# Altium schematic sheet Power.SchDoc
size A
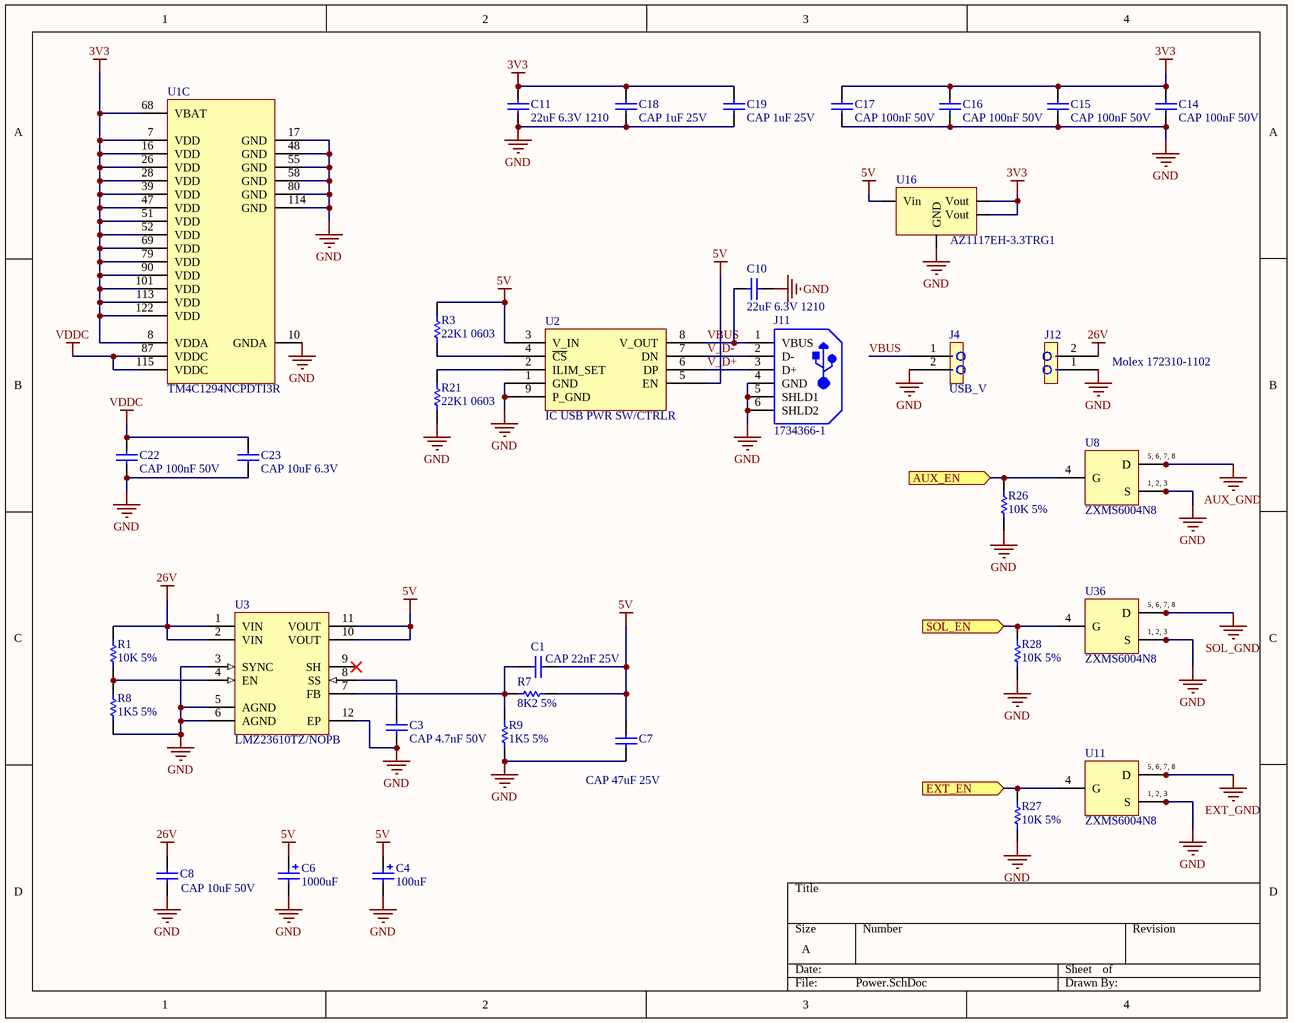
[diagram p0: Power.SchDoc]

## Parts
C1  CAP 22nF 25V  [CAPC0805(2012)100_M]
C3  CAP 4.7nF 50V  [CAPC0603(1608)100_M]
C4  100uF  [PANASONIC_C]
C6  1000uF  [PANASONIC_H13]
C7  CAP 47uF 25V  [CAPC1206(3216)100_L]
C8  CAP 10uF 50V  [CAPC1206(3216)190_M]
C10  22uF 6.3V 1210  [CAPC1210(3225)220_N]
C11  22uF 6.3V 1210  [CAPC1210(3225)220_N]
C14  CAP 100nF 50V  [CAPC0603(1608)100_M]
C15  CAP 100nF 50V  [CAPC0603(1608)100_M]
C16  CAP 100nF 50V  [CAPC0603(1608)100_M]
C17  CAP 100nF 50V  [CAPC0603(1608)100_M]
C18  CAP 1uF 25V  [CAPC0603(1608)100_M]
C19  CAP 1uF 25V  [CAPC0603(1608)100_M]
C22  CAP 100nF 50V  [CAPC0603(1608)100_M]
C23  CAP 10uF 6.3V  [CAPC0603(1608)100_M]
J4  USB_V  [1X2]
J11  1734366-1  [TE-1734366-1_V]
J12  Molex 172310-1102  [Molex 172310-1102]
R1  10K 5%  [RESC0603(1608)_M]
R3  22K1 0603  [RESC0603(1608)_N]
R7  8K2 5%  [RESC0603(1608)_M]
R8  1K5 5%  [RESC0603(1608)_M]
R9  1K5 5%  [RESC0603(1608)_M]
R21  22K1 0603  [RESC0603(1608)_N]
R26  10K 5%  [RESC0603(1608)_N]
R27  10K 5%  [RESC0603(1608)_N]
R28  10K 5%  [RESC0603(1608)_N]
U1  TM4C1294NCPDTI3R  [TI-PDT128_M]  (part C of 3)
U2  IC USB PWR SW/CTRLR  [8-MSOP-PowerPad]
U3  LMZ23610TZ/NOPB  [NDY0011A_M]
U8  ZXMS6004N8  [SO-8]
U11  ZXMS6004N8  [SO-8]
U16  AZ1117EH-3.3TRG1  [SOT-223]
U36  ZXMS6004N8  [SO-8]

## Ports
AUX_EN (in), EXT_EN (in), SOL_EN (in)

## Nets
3V3: C11.2 C14.2 C15.2 C16.2 C17.2 C18.2 C19.2 U1.7(VDD) U1.8(VDDA) U1.16(VDD) U1.26(VDD) U1.28(VDD) U1.39(VDD) U1.47(VDD) U1.51(VDD) U1.52(VDD) U1.68(VBAT) U1.69(VDD) U1.79(VDD) U1.90(VDD) U1.101(VDD) U1.113(VDD) U1.122(VDD) U16.2(Vout) U16.4(Vout)
5V: C1.2 C4.+ C6.+ C7.1 R3.1 R7.1 U2.3(V_IN) U2.5(EN) U3.10(VOUT) U3.11(VOUT) U16.3(Vin)
26V: C8.1 J12.2 R1.2 U3.1(VIN) U3.2(VIN)
AUX_GND: U8.5(D) U8.6(D) U8.7(D) U8.8(D)
EXT_GND: U11.5(D) U11.6(D) U11.7(D) U11.8(D)
GND: C3.1 C4.- C6.- C7.2 C8.2 C10.2 C11.1 C14.1 C15.1 C16.1 C17.1 C18.1 C19.1 C22.1 C23.1 J4.2 J11.4(GND) J11.5(SHLD1) J11.6(SHLD2) J12.1 R8.1 R9.1 R21.1 R26.1 R27.1 R28.1 U1.10(GNDA) U1.17(GND) U1.48(GND) U1.55(GND) U1.58(GND) U1.80(GND) U1.114(GND) U2.1(GND) U2.9(P_GND) U3.3(SYNC) U3.5(AGND) U3.6(AGND) U3.12(EP) U8.1(S) U8.2(S) U8.3(S) U11.1(S) U11.2(S) U11.3(S) U16.1(GND) U36.1(S) U36.2(S) U36.3(S)
SOL_GND: U36.5(D) U36.6(D) U36.7(D) U36.8(D)
VDDC: C22.2 C23.2 U1.87(VDDC) U1.115(VDDC)
AUX_EN: R26.2 U8.4(G) ; port AUX_EN
EXT_EN: R27.2 U11.4(G) ; port EXT_EN
SOL_EN: R28.2 U36.4(G) ; port SOL_EN
V_D+: J11.3(D+) U2.6(DP)
V_D-: J11.2(D-) U2.7(DN)
VBUS: C10.1 J4.1 J11.1(VBUS) U2.8(V_OUT)
NetC1_1: C1.1 R7.2 R9.2 U3.7(FB)
NetC3_2: C3.2 U3.8(SS)
NetR1_1: R1.1 R8.2 U3.4(EN)
NetR3_2: R3.2 U2.4(~{CS})
NetR21_2: R21.2 U2.2(ILIM_SET)

Not connected (* = marked no-connect by the designer): U3 9(SH)*

## Notes on the sheet
- (in symbol ZXMS6004N8) 5, 6, 7, 8; 1, 2, 3

## Library data of the parts
C1 = CMP-1036-04051-1: CAP 22nF 25V Â±5% 0805 (2012 Metric) Thickness 1mm SMD; Case-Metric: 2012; Case-EIA: 0805; Technology: SMT; Max Thickness: 1 mm; Value: 22nF; Rated Voltage: 25 V; Tolerance: Â±5%
C3 = CMP-1035-00333-1: CAP 4.7nF 50V Â±20% 0603 (1608 Metric) Thickness 1mm SMD; Case-EIA: 0603; Case-Metric: 1608; Max Thickness: 1 mm; Rated Voltage: 50 V; Technology: SMT; Tolerance: Â±20%; Value: 4.7nF
C4 = Cap_Polarized_100uF: Polarized Capacitor (Surface Mount); Published: 8-Jun-2000; LatestRevisionDate: 29-May-2009; LatestRevisionNote: IPC-7351 Footprint Added.; PackageReference: C0805; Publisher: Altium Limited; PackageDescription: Chip Capacitor; Value: 100uF; Supplier 1: Digi-Key; Supplier 2: Mouser; Supplier Part Number 1: PCE4718CT-ND; Supplier Part Number 2: 667-EEE-HAJ101WAR
C6 = Cap_Polarized_1000uF: Polarized Capacitor (Surface Mount); Published: 8-Jun-2000; LatestRevisionDate: 29-May-2009; LatestRevisionNote: IPC-7351 Footprint Added.; PackageReference: C0805; Publisher: Altium Limited; PackageDescription: Chip Capacitor; Value: 1000uF; Supplier 1: Digi-Key; Supplier 2: Mouser; Supplier Part Number 1: PCE3462CT-ND; Supplier Part Number 2: 140-VE102M1ETR1313
C7 = CMP-1037-00376-1: CAP 47uF 25V Â±0.25pF 1206 (3216 Metric) Thickness 1mm SMD; Case-EIA: 1206; Case-Metric: 3216; Technology: SMT; Max Thickness: 1 mm; Value: 47uF; Tolerance: Â±0.25pF; Rated Voltage: 25 V
C8 = CMP-1037-04982-1: CAP 10uF 50V Â±10% 1206 (3216 Metric) Thickness 1.9mm SMD; Case-EIA: 1206; Case-Metric: 3216; Technology: SMT; Tolerance: Â±10%; Max Thickness: 1.9 mm; Value: 10uF; Rated Voltage: 50 V
C10 C11 = CMP-1038-02259-1: CAP 22uF 6.3V ±10% 1210 (3225 Metric) Thickness 2.2mm SMD; Case-Metric: 3225; Case-EIA: 1210; Tolerance: Â±10%; Max Thickness: 2.2 mm; Rated Voltage: 6.3 V; Technology: SMT; Value: 22uF
C14-C17 C22 = CMP-1035-00010-1: CAP 100nF 50V Â±0.1pF 0603 (1608 Metric) Thickness 1mm SMD; Case-Metric: 1608; Case-EIA: 0603; Tolerance: Â±0.1pF; Technology: SMT; Value: 100nF; Max Thickness: 1 mm; Rated Voltage: 50 V
C18 C19 = CMP-1035-00037-1: CAP 1uF 25V Â±0.25pF 0603 (1608 Metric) Thickness 1mm SMD; Case-Metric: 1608; Case-EIA: 0603; Tolerance: Â±0.25pF; Max Thickness: 1 mm; Value: 1uF; Technology: SMT; Rated Voltage: 25 V
C23 = CMP-1035-02796-1: CAP 10uF 6.3V ±10% 0603 (1608 Metric) Thickness 1mm SMD; Case-EIA: 0603; Tolerance: Â±10%; Case-Metric: 1608; Value: 10uF; Technology: SMT; Rated Voltage: 6.3 V; Max Thickness: 1 mm
J4 J12 = CON2: 6.35mm right-angle 90° male spade terminal PCB mount; CID: 643; CID2: 643; CID3: 643
J11 = CMP-1684-00007-1: Recept Assy, Vertical, 4 Position, Thru-Hole, Type A USB, RoHS, Tray; Case\Package: SMA; Peak Reverse Current: 200 uA; Forward Voltage: 500 mV; Max Surge Current: 40 A; Max Operating Temperature: 125 degC; ComponentLink1URL: http://www.te.com/; Mount: Surface Mount; ComponentLink2URL: http://www.te.com/commerce/DocumentDelivery/DDEController?Action=showdoc&DocId=Customer+Drawing%7F1734366%7FC3%7Fpdf%7FEnglish%7FENG_CD_1734366_C3.pdf%7F1734366-1; ComponentLink2Description: Datasheet; Pins: 2; RoHSCompliant: true; REACH SVHC: No SVHC; Radiation Hardening: No; Min Operating Temperature: -65 degC; PackageReference: 1734366-1; PackageDescription: 6-Pin Through Hole Device, Length 15 mm, Height 15 mm, Tail Length 2.8 mm; ComponentLink1Description: Manufacturer URL; Package Quantity: 7500; DatasheetVersion: Rev. C3, 03/2016; Packaging: Tape and Reel
R1 R26-R28 = CMP-1012-00098-1: 10K 0.1W 5% 0603 (1608 Metric)  SMD; Case-EIA: 0603; Value: 10000.00 Ohm; Case-Metric: 1608; Technology: SMT; Tolerance: 5 %; Power: 0.1 W
R3 R21 = CMP-1012-00660-1: 22K1 0.1W 1% 0603 (1608 Metric)  SMD; Case-EIA: 0603; Case-Metric: 1608; Value: 22100.00 Ohm; Tolerance: 1 %; Power: 0.1 W; Technology: SMT
R7 = CMP-1012-00096-1: 8K2 0.1W 5% 0603 (1608 Metric)  SMD; Value: 8200.00 Ohm; Case-EIA: 0603; Case-Metric: 1608; Tolerance: 5 %; Technology: SMT; Power: 0.1 W
R8 R9 = CMP-1012-00078-1: 1K5 0.1W 5% 0603 (1608 Metric)  SMD; Case-Metric: 1608; Case-EIA: 0603; Value: 1500.00 Ohm; Technology: SMT; Power: 0.1 W; Tolerance: 5 %
U1 = CMP-0945-00007-1: Tiva C Series Microcontroller, 1024 KB Flash, 256 KB SRAM, 12 Bit, 20 Channels, -40 to 85 degC, 128-Pin TQFP (PDT), Green (RoHS & no Sb/Br), Tape and Reel; Manufacturer: Texas Instruments; SRAM: 256 KB; ADC Resolution: 12 Bits; ADC Channels: 20; Flash: 1024 KB; Max Speed: 120 MHz; CPU: ARM Cortex-M4; Packing: Tape and Reel; Mounting Technology: Surface Mount; Eco-Plan: Green (RoHS & no Sb/Br); ComponentLink1URL: http://www.ti.com/; ComponentLink3Description: Package Specification; ComponentLink2Description: Datasheet; PartNumber: TM4C1294NCPDTI3R; DatasheetVersion: 15863.2743; ComponentLink1Description: Manufacturer URL; ComponentLink3URL: http://www.ti.com/lit/ml/mpqf013/mpqf013.pdf; Temperature Range: -40 to 85 degC; ComponentLink2URL: http://www.ti.com/lit/ds/symlink/tm4c1294ncpdt.pdf; PackageVersion: 4087726/A; PackageDescription: 128-Pin Thin Quad Flat Package, Body 14 x 14 mm, Pitch 0.4 mm; PartId: 2
U2 = IC USB PWR SW/CTRLR: USB Dedicated Charging Port, Power Switch; Supplier 1: Digikey; Supplier Part Number 1: 296-30552-1-ND
U3 = CMP-0069-02067-2: 10A SIMPLE SWITCHER® Power Module with 36V Maximum Input Voltage and Current Sharing, 11 pin TO-PMOD, 32 Rail; Manufacturer: Texas Instruments; PackageTopMarking: NSUZXYTTE#*LMZ23610; PowerWise: N; RoHS: Y; ComponentLink1Description: Datasheet URL; PinCount: 11; PackageDescription: TO-PMOD, 15 x 15 x 5.9 mm Body, 11 Lead, 1.27 mm Pitch, Surface Mount; ComponentLink1URL: http://www.ti.com/general/docs/lit/getliterature.tsp?genericPartNumber=LMZ23610&fileType=pdf; PackageReference: NDY0011A; CompType: Switcher
U8 U11 U36 = ZXMS6004N8: MOSFET N-CH 60V 1.3A S08; Manufacturer: On Semiconductor; PartNumber: NCV8402ASTT1G; Packing: Tape and Reel; Channel Polarity: N Channel; ComponentLink3Description: Package Specification; ComponentLink3URL: http://www.onsemi.com/pub_link/Collateral/318E-04.PDF; ComponentLink1URL: http://www.onsemi.com/; PackageDescription: 4-Pin Small Outline Transistor, Body 6.5 x 3.5 mm, Pitch 2.3 mm; DatasheetVersion: Rev. 8; ComponentLink1Description: Manufacturer URL; Mounting Technology: Surface Mount; PackageVersion: Rev. N, 08/2009; PackageReference: SOT-223-4-318E-04; ComponentLink2URL: http://www.onsemi.com/pub_link/Collateral/NCV8402-D.PDF; ComponentLink2Description: Datasheet; RoHS: Pb-Free
U16 = AZ1117EH: Reg 1A 3V3 OUT SIP VERT; Supplier 1: Digi-Key; Supplier Part Number 1: AZ1117EH-3.3TRG1DICT-ND